# EAGLE design mainboardv0.2.2 (EAGLE 6.5.0)
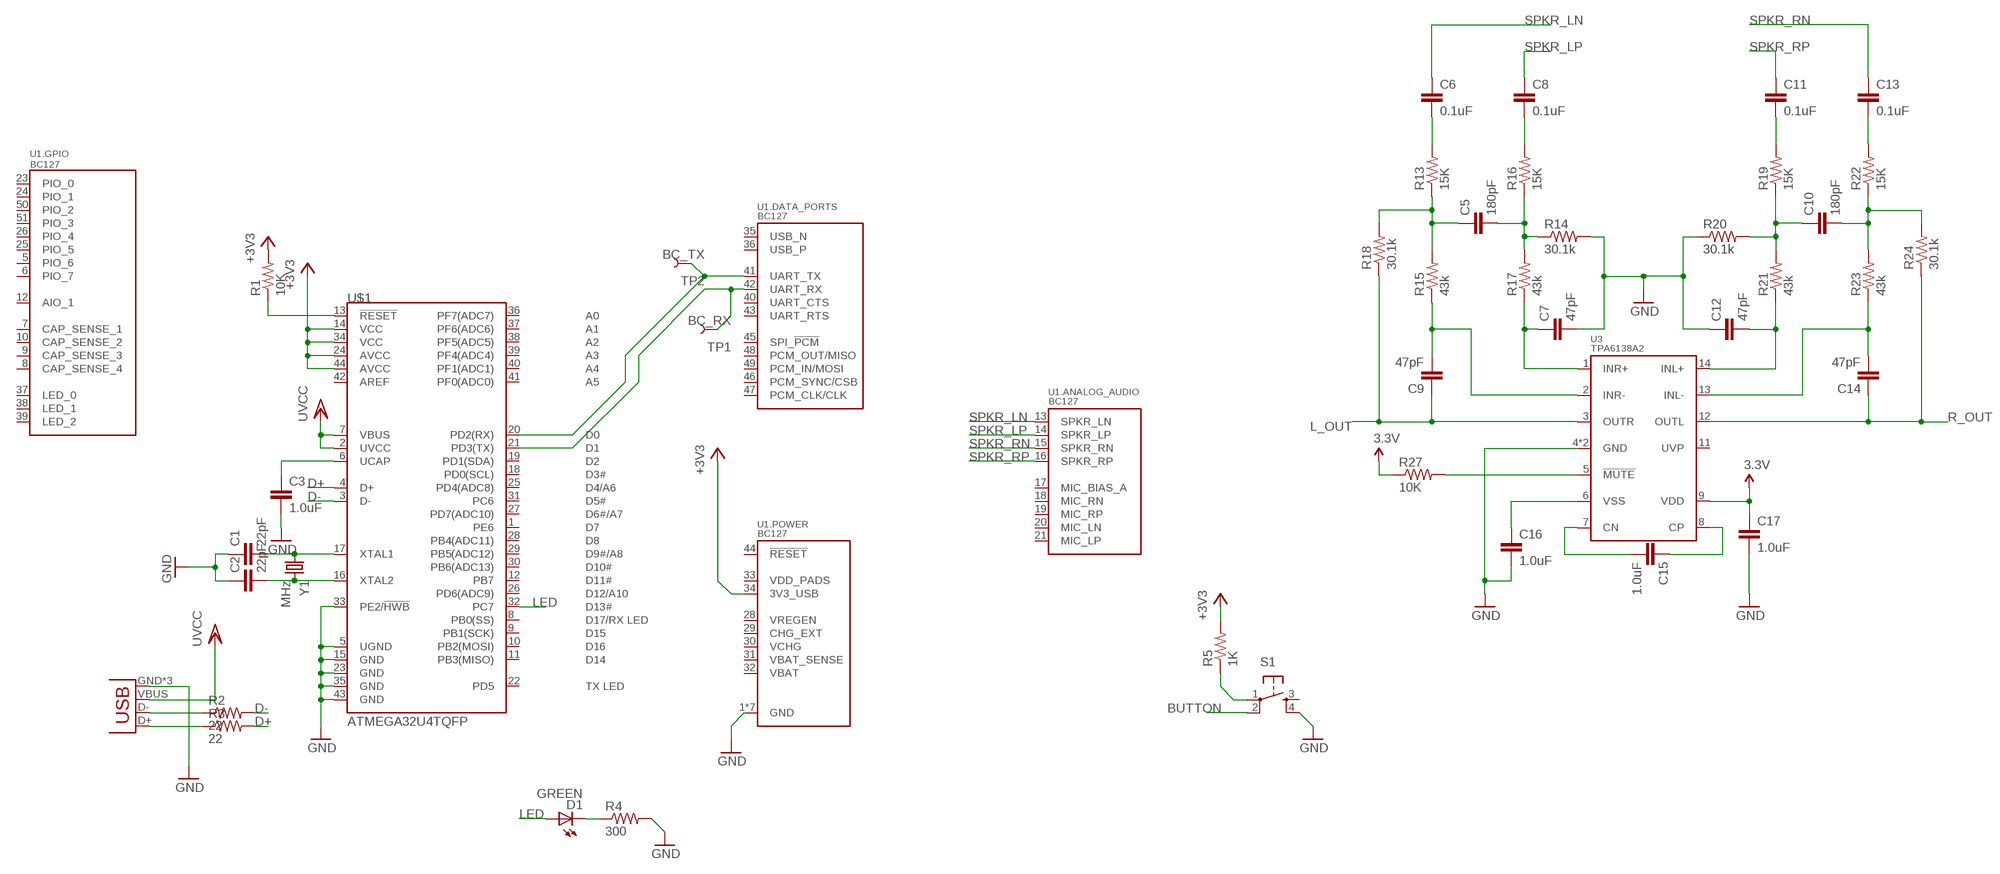
[diagram p0: schematic, sheet 1]

## Parts
C1  22pF  22PF-50V-5%(0603)  [0603-CAP]
C2  22pF  22PF-50V-5%(0603)  [0603-CAP]
C3  1.0uF  1.0UF-16V-10%(0603)  [0603-CAP]
C5  180pF  CAP0603-CAP  [0603-CAP]
C6  0.1uF  0.1UF-25V-5%(0603)  [0603-CAP]
C7  47pF  47PF-50V-5%(0603)  [0603-CAP]
C8  0.1uF  0.1UF-25V-5%(0603)  [0603-CAP]
C9  47pF  47PF-50V-5%(0603)  [0603-CAP]
C10  180pF  CAP0603-CAP  [0603-CAP]
C11  0.1uF  0.1UF-25V-5%(0603)  [0603-CAP]
C12  47pF  47PF-50V-5%(0603)  [0603-CAP]
C13  0.1uF  0.1UF-25V-5%(0603)  [0603-CAP]
C14  47pF  47PF-50V-5%(0603)  [0603-CAP]
C15  1.0uF  1.0UF-16V-10%(0603)  [0603-CAP]
C16  1.0uF  1.0UF-16V-10%(0603)  [0603-CAP]
C17  1.0uF  1.0UF-16V-10%(0603)  [0603-CAP]
D1  GREEN  LED-GREENLARGE  [LED-1206]
JP1  USB-MICROB  [USB-MICROB]
R1  10K  10KOHM1/10W1%(0603)0603  [0603-RES]
R2  22  22OHM1/10W1%(0603)  [0603-RES]
R3  22  22OHM1/10W1%(0603)  [0603-RES]
R4  300  300OHM-1/10W-1%(0603)  [0603-RES]
R5  1K  1KOHM1/10W1%(0603)  [0603-RES]
R13  15K  15KOHM1/10W1%(0603)0603  [0603-RES]
R14  30.1k  30.1KOHM1/10W1%(0603)  [0603-RES]
R15  43k  43KOHM1/10W1%(0603)  [0603-RES]
R16  15K  15KOHM1/10W1%(0603)0603  [0603-RES]
R17  43k  43KOHM1/10W1%(0603)  [0603-RES]
R18  30.1k  30.1KOHM1/10W1%(0603)  [0603-RES]
R19  15K  15KOHM1/10W1%(0603)0603  [0603-RES]
R20  30.1k  30.1KOHM1/10W1%(0603)  [0603-RES]
R21  43k  43KOHM1/10W1%(0603)  [0603-RES]
R22  15K  15KOHM1/10W1%(0603)0603  [0603-RES]
R23  43k  43KOHM1/10W1%(0603)  [0603-RES]
R24  30.1k  30.1KOHM1/10W1%(0603)  [0603-RES]
R27  10K  10KOHM1/10W1%(0603)0603  [0603-RES]
S1  TAC_SWITCHSMD  [TACTILE_SWITCH_SMD]
TP1  BC_RX  TEST-POINT2  [PAD.02X.02]
TP2  BC_TX  TEST-POINT2  [PAD.02X.02]
U1  BC127  [BC127]
U3  TPA6138A2  [TSSOP-14]
U$1  ATMEGA32U4TQFP  [SPARKFUN-DIGITALIC_TQFP44]
Y1  MHz  CRYSTAL5X3  [CRYSTAL-SMD-5X3]

## Nets
3.3V: C17.1 R27.1 U3.9(VDD)
+3V3: R1.2 R5.2 U1.34(.POWER:3V3_USB) U$1.14(VCC) U$1.24(AVCC) U$1.34(VCC) U$1.44(AVCC)
BUTTON: S1.2
D+: R3.2 U$1.4(D+)
D-: R2.2 U$1.3(D-)
GND: C1.1 C2.1 C3.2 C7.2 C12.1 C16.2 C17.2 JP1.GND JP1.MT1(GND) JP1.MT2(GND) R4.2 R14.2 R20.1 S1.4 U1.1(.POWER:GND) U1.2(.POWER:GND) U1.3(.POWER:GND) U1.4(.POWER:GND) U1.11(.POWER:GND) U1.22(.POWER:GND) U1.27(.POWER:GND) U3.4(GND) U3.10(GND) U$1.5(UGND) U$1.15(GND) U$1.23(GND) U$1.33(PE2/!HWB) U$1.35(GND) U$1.43(GND)
L_OUT: C9.1 R18.1 U3.3(OUTR)
LED: D1.A U$1.32(PC7)
N$1: R1.1 U$1.13(!RESET)
N$2: C1.2 U$1.17(XTAL1) Y1.1
N$3: C2.2 U$1.16(XTAL2) Y1.3
N$4: C3.1 U$1.6(UCAP)
N$5: D1.C R4.1
N$6: R5.1 S1.1
N$7: JP1.D- R2.1
N$8: JP1.D+ R3.1
N$9: TP2.P$1 U1.41(.DATA_PORTS:UART_TX) U$1.20(PD2(RX))
N$10: TP1.P$1 U1.42(.DATA_PORTS:UART_RX) U$1.21(PD3(TX))
N$11: C8.2 R16.2
N$12: C6.2 R13.2
N$13: C5.1 R13.1 R15.2 R18.2
N$14: C9.2 R15.1 U3.2(INR-)
N$15: C7.1 R17.1 U3.1(INR+)
N$16: C5.2 R14.1 R16.1 R17.2
N$17: C10.1 R19.1 R20.2 R21.2
N$18: C12.2 R21.1 U3.14(INL+)
N$19: C11.2 R19.2
N$20: C10.2 R22.1 R23.2 R24.2
N$21: C13.2 R22.2
N$22: C14.2 R23.1 U3.13(INL-)
N$23: R27.2 U3.5(!MUTE)
N$24: C16.1 U3.6(VSS)
N$25: C15.2 U3.7(CN)
N$26: C15.1 U3.8(CP)
R_OUT: C14.1 R24.1 U3.12(OUTL)
SPKR_LN: C6.1 U1.13(.ANALOG_AUDIO:SPKR_LN)
SPKR_LP: C8.1 U1.14(.ANALOG_AUDIO:SPKR_LP)
SPKR_RN: C13.1 U1.15(.ANALOG_AUDIO:SPKR_RN)
SPKR_RP: C11.1 U1.16(.ANALOG_AUDIO:SPKR_RP)
VCC/2: JP1.VBUS U$1.2(UVCC) U$1.7(VBUS) ; supply symbol labelled UVCC
Unconnected: S1.3 U1.5(.GPIO:PIO_6) U1.6(.GPIO:PIO_7) U1.7(.GPIO:CAP_SENSE_1) U1.8(.GPIO:CAP_SENSE_4) U1.9(.GPIO:CAP_SENSE_3) U1.10(.GPIO:CAP_SENSE_2) U1.12(.GPIO:AIO_1) U1.17(.ANALOG_AUDIO:MIC_BIAS_A) U1.18(.ANALOG_AUDIO:MIC_RN) U1.19(.ANALOG_AUDIO:MIC_RP) U1.20(.ANALOG_AUDIO:MIC_LN) U1.21(.ANALOG_AUDIO:MIC_LP) U1.23(.GPIO:PIO_0) U1.24(.GPIO:PIO_1) U1.25(.GPIO:PIO_5) U1.26(.GPIO:PIO_4) U1.28(.POWER:VREGEN) U1.29(.POWER:CHG_EXT) U1.30(.POWER:VCHG) U1.31(.POWER:VBAT_SENSE) U1.32(.POWER:VBAT) U1.33(.POWER:VDD_PADS) U1.35(.DATA_PORTS:USB_N) U1.36(.DATA_PORTS:USB_P) U1.37(.GPIO:LED_0) U1.38(.GPIO:LED_1) U1.39(.GPIO:LED_2) U1.40(.DATA_PORTS:UART_CTS) U1.43(.DATA_PORTS:UART_RTS) U1.44(.POWER:!RESET) U1.45(.DATA_PORTS:SPI_!PCM) U1.46(.DATA_PORTS:PCM_SYNC/CSB) U1.47(.DATA_PORTS:PCM_CLK/CLK) U1.48(.DATA_PORTS:PCM_OUT/MISO) U1.49(.DATA_PORTS:PCM_IN/MOSI) U1.50(.GPIO:PIO_2) U1.51(.GPIO:PIO_3) U3.11(UVP) U$1.1(PE6) U$1.8(PB0(SS)) U$1.9(PB1(SCK)) U$1.10(PB2(MOSI)) U$1.11(PB3(MISO)) U$1.12(PB7) U$1.18(PD0(SCL)) U$1.19(PD1(SDA)) U$1.22(PD5) U$1.25(PD4(ADC8)) U$1.26(PD6(ADC9)) U$1.27(PD7(ADC10)) U$1.28(PB4(ADC11)) U$1.29(PB5(ADC12)) U$1.30(PB6(ADC13)) U$1.31(PC6) U$1.36(PF7(ADC7)) U$1.37(PF6(ADC6)) U$1.38(PF5(ADC5)) U$1.39(PF4(ADC4)) U$1.40(PF1(ADC1)) U$1.41(PF0(ADC0)) U$1.42(AREF)

## Library data of the parts
C1 C2 = SparkFun-Capacitors:22PF-50V-5%(0603): CAP-07876; PROD_ID: CAP-07876
C3 C15-C17 = SparkFun-Capacitors:1.0UF-16V-10%(0603): CAP-00868; PROD_ID: CAP-00868
C5 C10 = SparkFun-Capacitors:CAP: Capacitor Standard 0603 ceramic capacitor, and 0.1" leaded capacitor.; DIST: Digikey; DIST_ID: 1276-1255-2-ND
C6 C8 C11 C13 = SparkFun-Capacitors:0.1UF-25V-5%(0603): CAP-08604; PROD_ID: CAP-08604
C7 C9 C12 C14 = SparkFun-Capacitors:47PF-50V-5%(0603): CAP-08913; PROD_ID: CAP-08913
D1 = SparkFun-LED:LED-GREEN: Various green LEDs Green LEDs used in SFE Production 0603- DIO-00821 LARGE- DIO-00862 LILYPAD- DIO-09910; PROD_ID: DIO-00862
JP1 = SparkFun-Connectors:USB: USB Connectors USB-B-PTH is fully proven SKU : PRT-00139/CONN-08278 USB-miniB is fully proven SKU : PRT-00587 USB-A-PCB is untested. USB-A-H is throughly reviewed, but untested. Spark Fun Electronics SKU : PRT-00437 USB-B-SMT is throughly reviewed, but untested. Needs silkscreen touching up. USB-A-S has not been used/tested USB-MB-H has not been used/tested USB-MICROB has been used. CONN-09505; PROD_ID: CONN-09505
R1 R27 = SparkFun-Resistors:10KOHM1/10W1%(0603): RES-00824; PROD_ID: RES-00824
R2 R3 = SparkFun-Resistors:22OHM1/10W1%(0603): RES-08698; PROD_ID: RES-08698
R4 = SparkFun-Resistors:300OHM-1/10W-1%(0603): RES-10328; PROD_ID: RES_10328
R5 = SparkFun-Resistors:1KOHM1/10W1%(0603): RES-07856; PROD_ID: RES-07856
R13 R16 R19 R22 = SparkFun-Resistors:15KOHM1/10W1%(0603): RES-07854; PROD_ID: RES-07854
R14 R18 R20 R24 = SparkFun-Resistors:30.1KOHM1/10W1%(0603): RES-08595; PROD_ID: RES-08595
R15 R17 R21 R23 = SparkFun-Resistors:43KOHM1/10W1%(0603): RES-07858; PROD_ID: RES-07858
S1 = SparkFun-Electromechanical:TAC_SWITCH: Momentary Switch Button commonly used for reset or general input. Spark Fun Electronics SKU : COM-00097 SMT- SWCH-08247; PROD_ID: SWCH-08247
TP1 TP2 = SparkFun-Passives:TEST-POINT: Bare copper test points for troubleshooting or ICT
U1 = SparkFun-RF:BC127: Blue Creations BC127 BLE module Hyper-competent Bluetooth 4.0 module, with: - Pre-4.0 support - 4 Cap sense inputs - 1 Analog input - 8 GPIO - 3 Open-drain LED drivers - Onboard battery charge circuitry - SPP/UART support - PCM Audio support - SPI port - Built-in USB - All kinds of other crazy crap
U3 = SparkFun-AnalogIC:TPA6138A2: Headphone driver amp Differential to single-ended audio amplifier.; PROD_ID: IC-11779
U$1 = SparkFun-DigitalIC:ATMEGA32U4: Atmel 44-pin 8-bit Microcontroller with 32KBytes of ISP Flash and USB Controller ----- Please use the QFN-44-NOPAD_1:1 package for the footprint of all boards using a 32U4. Route traces directly away from the pads as much as possible.; PROD_ID: IC-11161
Y1 = SparkFun-FreqCtrl:CRYSTAL: Various standard crystals. Proven footprints. Spark Fun Electronics SKU : COM-00534

## Board
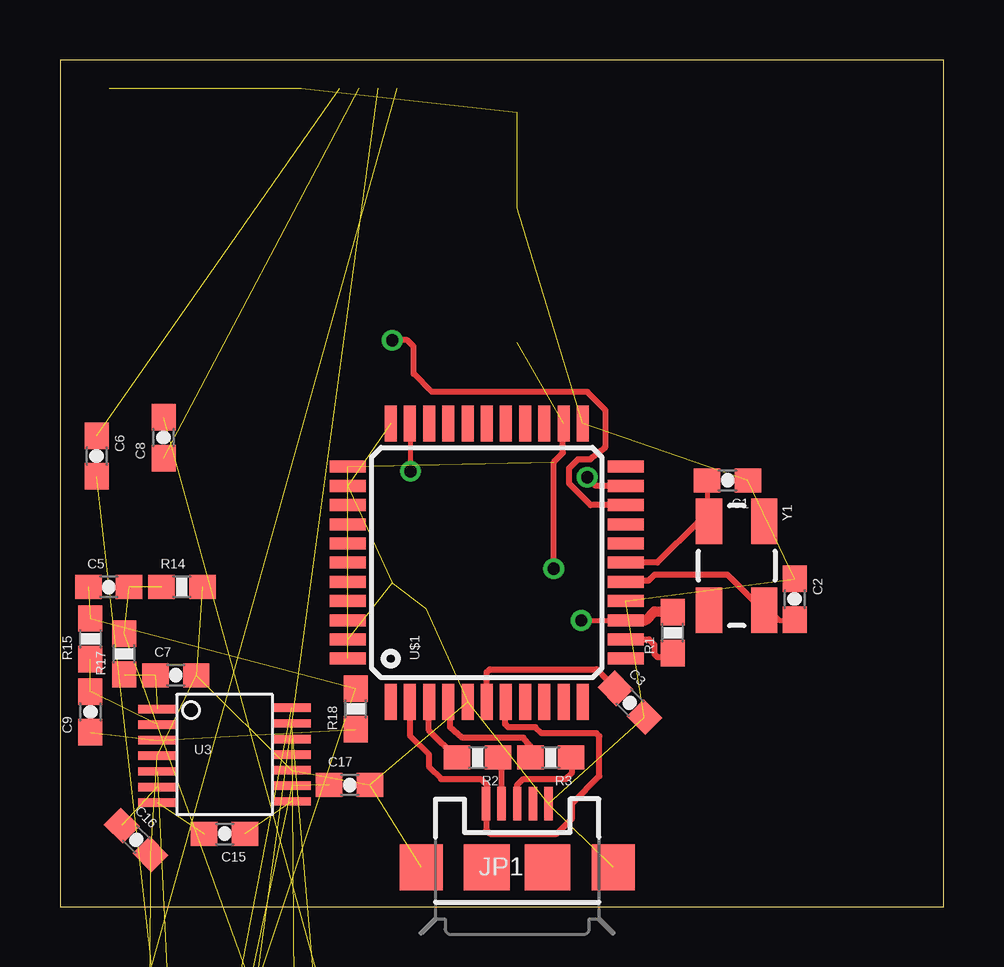
[diagram p1: board, top side]
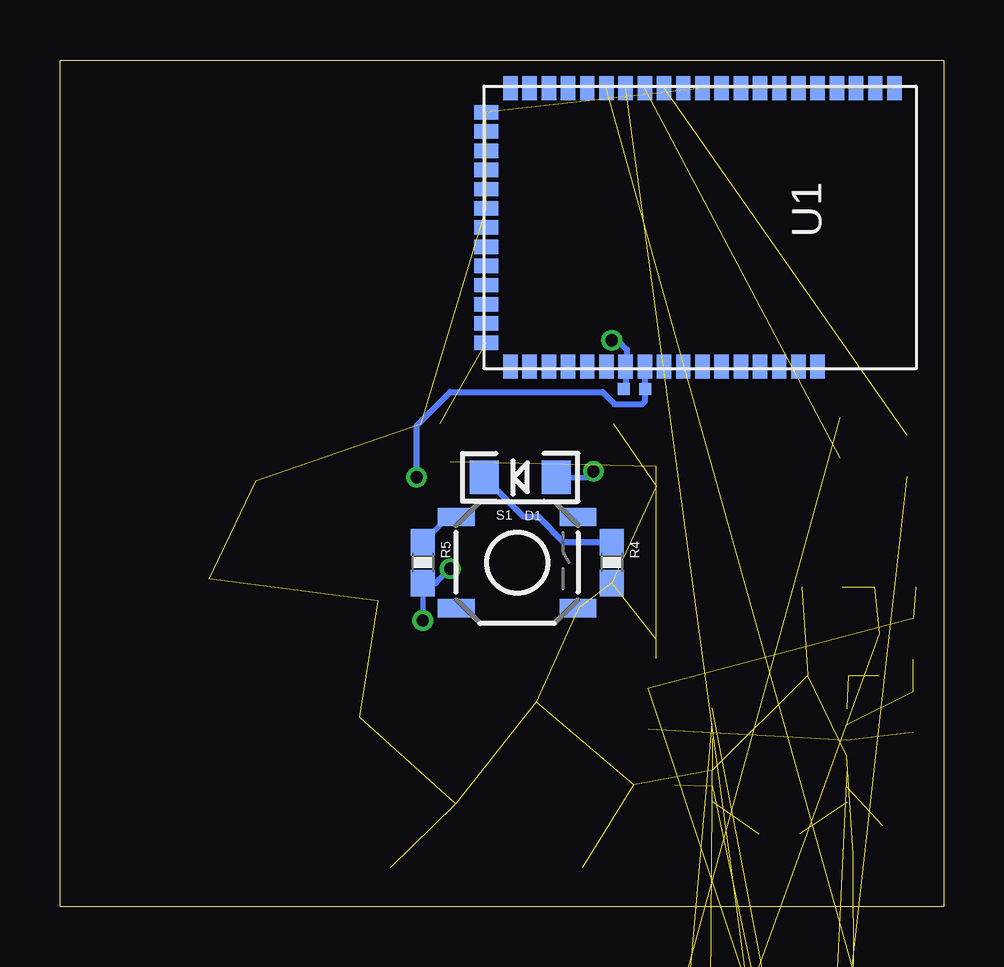
[diagram p2: board, bottom side, seen from below]

Size 36.83 x 35.31 mm. Coordinates in mm from the lower left corner, seen from the top.
Outline: 0,0 36.83,0 36.83,35.31 0,35.31 0,0
Copper layers (1*16): Top 0.0356mm / dielectric 1.5011mm / Bottom 0.0356mm
Design rules "LaenPCBOrder": minimum track width 6mil, minimum drill 13mil, track to track 6mil, track to pad 6mil, pad to pad 6mil, via to via 6mil, smd to smd 6mil, copper to edge 15mil, drill to drill 6mil, minimum pad ring 7mil, minimum via ring 7mil, stop-mask expansion 3mil, vias tented up to drill 0mil, thermal gap 10mil

### Footprints (pad centres in the part's own frame; a part is rotated, then mirrored left to right if it is on the bottom)
0603-CAP = smd 1.1 x 1: 1 -0.85,0; 2 0.85,0
LED-1206 = smd 1.2 x 1.4: A -1.5,0; C 1.5,0
USB-MICROB = smd 0.35 x 1.4: D+ 0,2.65; D- -0.65,2.65; GND 1.3,2.65; ID 0.65,2.65; VBUS -1.3,2.65 | smd 1.8 x 1.9: MT1 -4,0; MT2 4,0 | smd 1.9 x 1.9: P$1 -1.27,0; P$2 1.27,0
0603-RES = smd 1.1 x 1: 1 -0.85,0; 2 0.85,0
TACTILE_SWITCH_SMD = smd 1.524 x 0.762: 1 -2.54,1.905; 2 2.54,1.905; 3 -2.54,-1.905; 4 2.54,-1.905
PAD.02X.02 = smd 0.508 x 0.508: P$1 0,0
BC127 = smd 1 x 0.6: 1 -5.8,8.1; 2 -5.8,7.3; 3 -5.8,6.5; 4 -5.8,5.7; 5 -5.8,4.9; 6 -5.8,4.1; 7 -5.8,3.3; 8 -5.8,2.5; 9 -5.8,1.7; 10 -5.8,0.9; 11 -5.8,0.1; 12 -5.8,-0.7; 13 -5.8,-1.5; 14 -5.8,-2.3; 15 -5.8,-3.1; 16 -5.8,-3.9; 17 -5.8,-4.7; 18 -5.8,-5.5; 19 -5.8,-6.3; 20 -5.8,-7.1; 21 -5.8,-7.9; 35 5.8,-7.9; 36 5.8,-7.1; 37 5.8,-6.3; 38 5.8,-5.5; 39 5.8,-4.7; 40 5.8,-3.9; 41 5.8,-3.1; 42 5.8,-2.3; 43 5.8,-1.5; 44 5.8,-0.7; 45 5.8,0.1; 46 5.8,0.9; 47 5.8,1.7; 48 5.8,2.5; 49 5.8,3.3; 50 5.8,4.1; 51 5.8,4.9 | smd 0.6 x 1: 22 -4.8,-8.9; 23 -4,-8.9; 24 -3.2,-8.9; 25 -2.4,-8.9; 26 -1.6,-8.9; 27 -0.8,-8.9; 28 0,-8.9; 29 0.8,-8.9; 30 1.6,-8.9; 31 2.4,-8.9; 32 3.2,-8.9; 33 4,-8.9; 34 4.8,-8.9
TSSOP-14 = smd 1.6 x 0.35: 1 -2.8,1.9; 2 -2.8,1.25; 3 -2.8,0.6; 4 -2.8,-0.05; 5 -2.8,-0.7; 6 -2.8,-1.35; 7 -2.8,-2; 8 2.8,-1.95; 9 2.8,-1.3; 10 2.8,-0.65; 11 2.8,0; 12 2.8,0.65; 13 2.8,1.3; 14 2.8,1.95
SPARKFUN-DIGITALIC_TQFP44 = smd 1.5 x 0.5: 1 -5.8,4; 2 -5.8,3.2; 3 -5.8,2.4; 4 -5.8,1.6; 5 -5.8,0.8; 6 -5.8,0; 7 -5.8,-0.8; 8 -5.8,-1.6; 9 -5.8,-2.4; 10 -5.8,-3.2; 11 -5.8,-4; 23 5.8,-4; 24 5.8,-3.2; 25 5.8,-2.4; 26 5.8,-1.6; 27 5.8,-0.8; 28 5.8,0; 29 5.8,0.8; 30 5.8,1.6; 31 5.8,2.4; 32 5.8,3.2; 33 5.8,4 | smd 0.5 x 1.5: 12 -4,-5.8; 13 -3.2,-5.8; 14 -2.4,-5.8; 15 -1.6,-5.8; 16 -0.8,-5.8; 17 0,-5.8; 18 0.8,-5.8; 19 1.6,-5.8; 20 2.4,-5.8; 21 3.2,-5.8; 22 4,-5.8; 34 4,5.8; 35 3.2,5.8; 36 2.4,5.8; 37 1.6,5.8; 38 0.8,5.8; 39 0,5.8; 40 -0.8,5.8; 41 -1.6,5.8; 42 -2.4,5.8; 43 -3.2,5.8; 44 -4,5.8
CRYSTAL-SMD-5X3 = smd 1.9 x 1.1: 1 -1.85,-1.15; 2 1.85,-1.15; 3 1.85,1.15; 4 -1.85,1.15

### Placement (x,y rotation side)
C1  27.81,17.78 180 top
C2  30.61,12.83 270 top
C3  23.75,8.51 315 top
C5  2.03,13.34 0 top
C6  1.52,18.8 270 top
C7  4.83,9.65 0 top
C8  4.32,19.56 90 top
C9  1.27,8.13 90 top
C10  16.76,-10.67 0 top  (outside the outline)
C11  1.52,-13.72 0 top  (outside the outline)
C12  4.57,-13.72 0 top  (outside the outline)
C13  7.62,-13.72 0 top  (outside the outline)
C14  10.67,-13.72 0 top  (outside the outline)
C15  6.86,3.05 180 top
C16  3.17,2.79 315 top
C17  12.06,5.08 0 top
D1  17.65,17.91 180 bottom
JP1  19.05,1.65 0 top
R1  25.53,11.43 90 top
R2  17.4,6.22 180 top
R3  20.45,6.22 180 top
R4  13.84,14.35 270 bottom
R5  21.72,14.35 270 bottom
R13  4.57,-16.76 0 top  (outside the outline)
R14  5.08,13.34 0 top
R15  1.27,11.18 90 top
R16  13.72,-16.76 0 top  (outside the outline)
R17  2.67,10.54 90 top
R18  12.32,8.26 90 top
R19  4.57,-19.81 0 top  (outside the outline)
R20  7.62,-19.81 0 top  (outside the outline)
R21  10.67,-19.81 0 top  (outside the outline)
R22  13.72,-19.81 0 top  (outside the outline)
R23  16.76,-19.81 0 top  (outside the outline)
R24  1.52,-22.86 0 top  (outside the outline)
R27  4.57,-22.86 0 top  (outside the outline)
S1  17.78,14.35 0 bottom
TP1  12.45,21.59 90 bottom
TP2  13.34,21.59 0 bottom
U1  10.16,28.32 270 bottom
U3  6.86,6.35 0 top
U$1  17.78,14.35 90 top
Y1  28.19,14.22 270 top

### Tracks (layer width: path | path; a pad name or v marks a point on that pad's centre or on a via)
3.3V  (2 unrouted)
+3V3  (via drill 0.51)  (3 unrouted)
  Top 0.203: v21.72,11.94 23.57,11.94 U$1.14
  Top 0.254: v20.57,14.1 20.57,18.54 20.95,18.92 20.95,20.13 U$1.24
  Top 0.406: U$1.14 24.4,11.95 24.77,12.32 25.49,12.32 R1.2
  Bottom 0.203: R5.2 v21.72,11.94
  Bottom 0.254: R5.2 21.17,13.5 v20.57,14.1
D+
  Top 0.254: R3.2 19.6,6.69 19.3,7.05 16.76,7.05 16.26,7.49 16.26,8.47 U$1.4
D-
  Top 0.254: R2.2 16.51,6.22 15.37,7.37 15.37,8.54 U$1.3
GND  (28 unrouted)
L_OUT  (2 unrouted)
LED  (via drill 0.51)
  Top 0.203: v14.61,18.16 14.61,20.13 U$1.32
  Bottom 0.203: D1.A 14.86,17.91 v14.61,18.16
N$1
  Top 0.254: U$1.13 24.54,11.15 24.77,10.92 24.77,10.54 24.89,10.41 25.36,10.41 R1.1
N$2
  Top 0.203: C1.2 26.96,16.16 Y1.1
  Top 0.254: Y1.1 26.61,16.07 24.89,14.35 U$1.17
N$3
  Top 0.203: Y1.3 29.54,12.37 29.97,11.94 30.57,11.94 C2.2
  Top 0.254: Y1.3 29.28,12.37 27.81,13.84 24.77,13.84 24.51,13.59 23.62,13.59 U$1.16
N$4
  Top 0.254: U$1.6 17.78,9.78 17.91,9.91 22.35,9.91 22.61,9.65 | 22.61,9.65 | 22.61,9.65 C3.1
N$5
  Bottom 0.254: R4.1 15.84,15.2 16.89,16.26 17.5,16.26 D1.C
N$6
  Bottom 0.203: S1.1 20.66,16.26 R5.1
N$7
  Top 0.254: JP1.D- 18.4,6.07 R2.1
N$8
  Top 0.254: JP1.D+ 19.05,5.08 19.3,5.33 21.08,5.33 21.34,5.59 21.34,6.18 R3.1
N$9  (via drill 0.51)
  Top 0.254: U$1.20 22.11,16.75 21.21,17.65 21.21,18.29 21.59,18.67 22.1,18.67 22.73,19.18 22.73,20.7 21.97,21.46 15.49,21.46 14.73,22.23 14.73,23.37 14.48,23.62 v13.84,23.62
  Bottom 0.254: TP2.P$1 13.26,21.66 U1.41 13.21,22.57 13.21,23.24 13.59,23.62 v13.84,23.62
N$10  (via drill 0.51)
  Top 0.254: U$1.21 22.33,17.55 v21.97,17.91
  Bottom 0.254: U1.42 12.46,21.6 TP1.P$1 12.45,21.08 12.57,20.95 13.72,20.95 14.22,21.46 20.57,21.46 21.97,20.07 v21.97,17.91
N$11  (1 unrouted)
N$12  (1 unrouted)
N$13  (3 unrouted)
N$14  (2 unrouted)
N$15  (2 unrouted)
  Top 0.254: 2.71,9.65 R17.1
N$16  (3 unrouted)
N$17  (3 unrouted)
N$18  (2 unrouted)
N$19  (1 unrouted)
N$20  (3 unrouted)
N$21  (1 unrouted)
N$22  (2 unrouted)
N$23  (1 unrouted)
N$24  (1 unrouted)
N$25  (1 unrouted)
N$26  (1 unrouted)
R_OUT  (2 unrouted)
SPKR_LN  (1 unrouted)
SPKR_LP  (1 unrouted)
SPKR_RN  (1 unrouted)
SPKR_RP  (1 unrouted)
VCC/2
  Top 0.254: U$1.7 18.54,8.51 18.54,7.62 18.67,7.49 19.81,7.49 20.07,7.24 22.35,7.24 22.48,7.11 22.48,5.46 21.34,4.32 21.34,3.68 20.7,3.05 17.91,3.05 17.75,3.21 JP1.VBUS 17.78,4.33 17.78,5.08 17.53,5.33 15.88,5.33 15.37,5.84 15.37,6.35 14.58,7.14 U$1.2